# EAGLE design Canzasi-Prot (EAGLE 7.6.0)
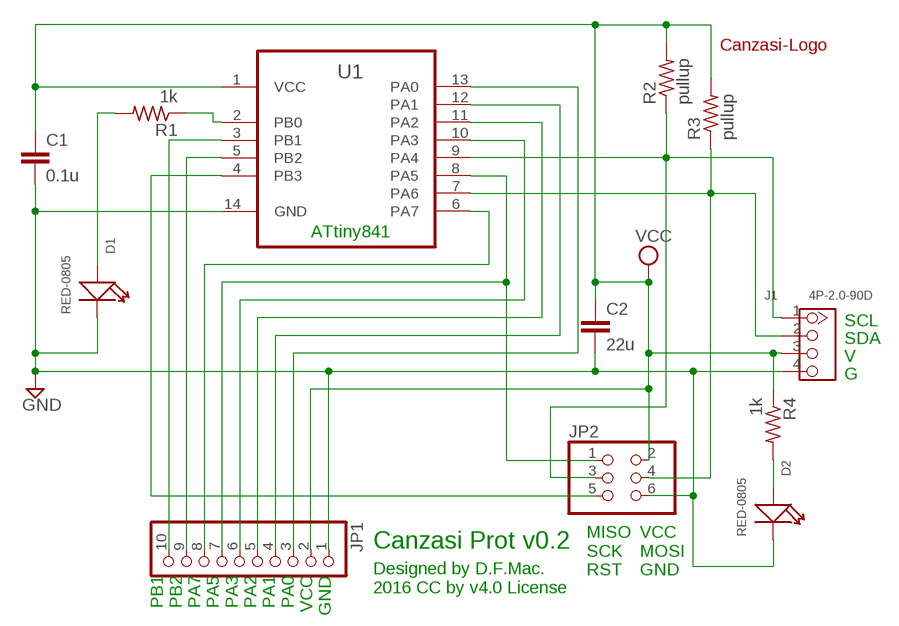
[diagram p0: schematic, sheet 1]

## Parts
C1  0.1u  C-EUC0603  [C0603]
C2  22u  C-EUC0805  [C0805]
D1  RED-0805  SMD-LED-CLEAR-RED(0805)  [LED-0805]
D2  RED-0805  SMD-LED-CLEAR-RED(0805)  [LED-0805]
J1  4P-2.0-90D  GROVE-CONNECTOR-DIP-90D(4P-2.0)  [HW4-2.0-90D]
JP1  PINHD-1X10  [1X10]
JP2  PINHD-2X3  [2X03]
R1  1k  R-US_R0603  [R0603]
R2  pullup  R-US_R0603  [R0603]
R3  pullup  R-US_R0603  [R0603]
R4  1k  R-US_R0603  [R0603]
U1  ATTINY44A-SSU  [SOIC127P600X175-14N]
U$1  CANZASI-LOGOMEDIUM  [CANZASI-LOGO-MEDIUM]

## Nets
GND [GND]: C1.2 C2.2 D1.- D2.- J1.4 JP1.1 JP2.6 U1.14(GND)
N$1: R1.1 U1.2(PB0)
N$2: D1.+ R1.2
N$3: J1.2 JP2.4 R3.1 U1.7(PA6)
N$4: J1.1 JP2.3 R2.1 U1.9(PA4)
N$5: JP1.10 U1.3(PB1)
N$6: JP1.9 U1.5(PB2)
N$7: JP2.5 U1.4(PB3)
N$8: JP1.8 U1.6(PA7)
N$9: JP1.7 JP2.1 U1.8(PA5)
N$10: JP1.6 U1.10(PA3)
N$11: JP1.5 U1.11(PA2)
N$12: JP1.4 U1.12(PA1)
N$13: JP1.3 U1.13(PA0)
N$14: D2.+ R4.2
VCC [VCC]: C1.1 C2.1 J1.3 JP1.2 JP2.2 R2.2 R3.2 R4.1 U1.1(VCC)

## Notes on the sheet
- ATtiny841
- SCL
- SDA
- V
- G
- Canzasi Prot v0.2
- PB1
  PB2
  PA7
  PA5
  PA3
  PA2
  PA1
  PA0
  VCC
  GND
- MISO
  SCK
  RST
- VCC
  MOSI
  GND
- Designed by D.F.Mac.
  2016 CC by v4.0 License

## Library data of the parts
C1 C2 = 0my:C-EU: CAPACITOR, European symbol
D1 D2 = Seeed-OPL-Diode:SMD-LED-CLEAR-RED(0805): 304090046; MPN: 17-215SURC/S530-A2/TR8
J1 = Seeed-OPL-Connector:GROVE-CONNECTOR-DIP-90D(4P-2.0): 320110034
JP1 = 0my:PINHD-1X10: PIN HEADER
JP2 = 0my:PINHD-2X3: PIN HEADER
R1-R4 = 0my:R-US_: RESISTOR, American symbol
U1 = Atmel_By_element14_Batch_1-00:ATTINY44A-SSU: 8-bit Microcontroller with In-System Programmable Flash; MPN: ATTINY44A-SSU; OC_FARNELL: 1699397; OC_NEWARK: 80P3683; PACKAGE: SOIC-14; SUPPLIER: Atmel
U$1 = 1my:CANZASI-LOGO

## Net classes
0 default: width 0.33 mm, drill 0.178 mm, clearance 0.152 mm
1 VCC: width 0.508 mm, drill 0.178 mm, clearance 0.152 mm
2 GND: width 0.508 mm, drill 0.178 mm, clearance 0.152 mm

## Board
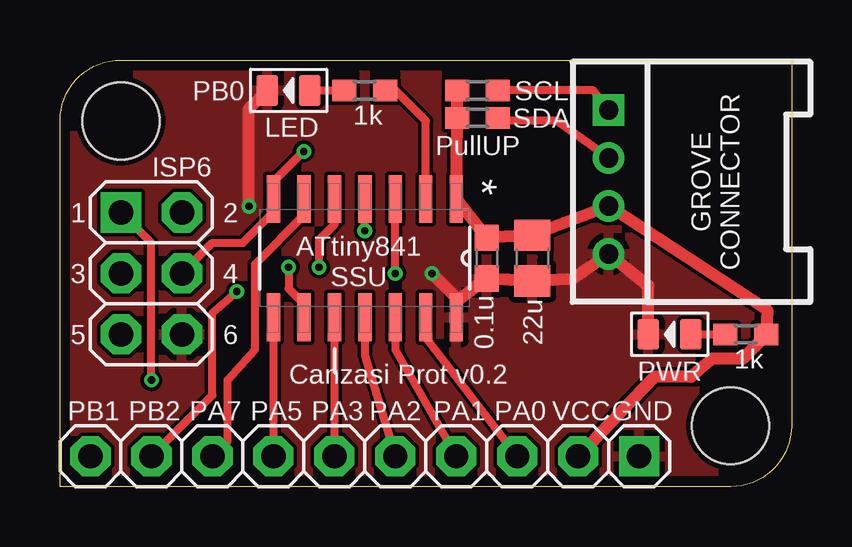
[diagram p1: board, top side]
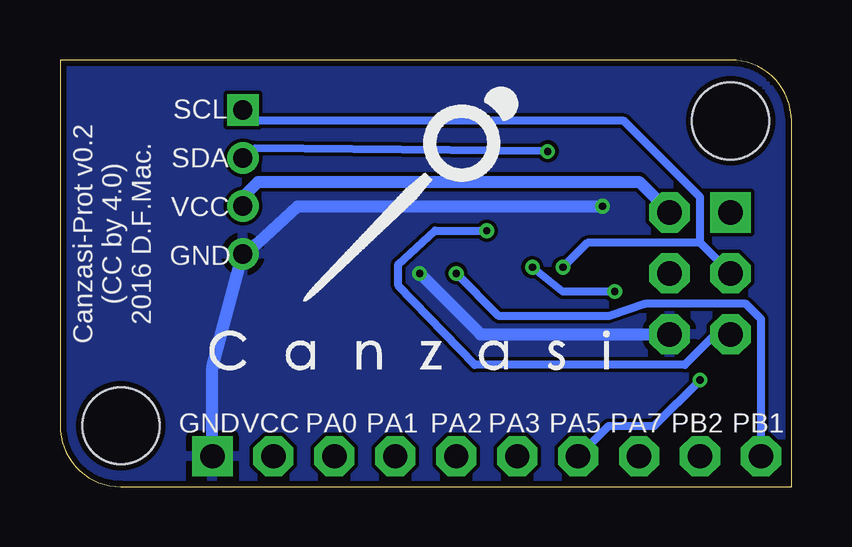
[diagram p2: board, bottom side, seen from below]

Size 30.48 x 17.78 mm. Coordinates in mm from the lower left corner, seen from the top.
Outline: 0,0 0,15.24 arc-90 2.54,17.78 30.48,17.78 30.48,2.54 arc-90 27.94,0 0,0
Copper layers (1*16): Top 0.035mm / dielectric 1.5mm / Bottom 0.035mm
Design rules "Elecrow_2-layer_eagle_rule": minimum track width 6mil, minimum drill 12mil, track to track 6mil, track to pad 6mil, pad to pad 6mil, via to via 6mil, smd to smd 0mil, copper to edge 10mil, drill to drill 10mil, minimum pad ring 10mil, minimum via ring 6mil, stop-mask expansion 2mil, vias tented up to drill 100mil, thermal gap 10mil
Holes 3.2 mm at 2.54,15.24 27.94,2.54

### Footprints (pad centres in the part's own frame; a part is rotated, then mirrored left to right if it is on the bottom)
C0603 = smd 1.1 x 1: 1 -0.85,0; 2 0.85,0
C0805 = smd 1.3 x 1.5: 1 -0.95,0; 2 0.95,0
LED-0805 = smd 0.889 x 1.27: + -0.889,0; - 0.889,0
HW4-2.0-90D = drill 0.8 pad 1.27 square: 1 -3,0 | drill 0.8 pad 1.27: 2 -1,0; 3 1,0; 4 3,0
1X10 = drill 1.016 pad 1.676 square: 1 -11.43,0 | drill 1.016 pad 1.676 octagon: 2 -8.89,0; 3 -6.35,0; 4 -3.81,0; 5 -1.27,0; 6 1.27,0; 7 3.81,0; 8 6.35,0; 9 8.89,0; 10 11.43,0
2X03 = drill 1.016 pad 1.676 square: 1 -2.54,-1.27 | drill 1.016 pad 1.676 octagon: 2 -2.54,1.27; 3 0,-1.27; 4 0,1.27; 5 2.54,-1.27; 6 2.54,1.27
R0603 = smd 1 x 0.9: 1 -0.85,0; 2 0.85,0
SOIC127P600X175-14N = smd 1.981 x 0.559: 1 -2.464,3.81; 2 -2.464,2.54; 3 -2.464,1.27; 4 -2.464,0; 5 -2.464,-1.27; 6 -2.464,-2.54; 7 -2.464,-3.81; 8 2.464,-3.81; 9 2.464,-2.54; 10 2.464,-1.27; 11 2.464,0; 12 2.464,1.27; 13 2.464,2.54; 14 2.464,3.81

### Placement (x,y rotation side)
C1  17.78,9.53 270 top
C2  19.68,9.53 270 top
D1  9.53,16.51 180 top
D2  25.4,6.35 180 top
J1  22.86,12.7 270 top
JP1  12.7,1.27 180 top
JP2  3.81,8.89 270 top
R1  12.7,16.51 180 top
R2  17.4,16.51 180 top
R3  17.4,15.37 180 top
R4  28.57,6.35 180 top
U1  12.7,9.53 270 top
U$1  25.02,4.06 0 bottom

### Tracks (layer width: path | path; a pad name or v marks a point on that pad's centre or on a via)
GND  (via drill 0.3)
  Top 0.508: 16.52,7.71 C1.2 C2.2 21.34,8.64 J1.4 24.51,8.38 D2.- | 16.52,7.71 U1.14 | D1.- 7.87,15.75 v7.87,11.68 | v15.49,8.89 16.51,7.87 16.51,7.62 16.52,7.71
  Bottom 0.508: JP1.1 24.13,4.95 J1.4 22.86,9.65 22.23,10.16 20.57,11.68 v7.87,11.68 | v15.49,8.89 12.95,6.35 JP2.6
  pour Top: 0.64,17.14 30.48,17.14 30.48,0.64 0.64,0.64
  pour Bottom: -0.64,17.78 31.11,17.78 31.11,0 -0.64,0
N$1
  Top 0.33: U1.2 15.24,15.24 13.97,16.51 R1.1
N$2
  Top 0.33: D1.+ R1.2
N$3  (via drill 0.3)
  Top 0.33: 22.86,13.72 20.7,15.24 18.41,15.24 R3.1 | 22.86,13.84 22.86,13.72 | 22.86,13.72 J1.2 | JP2.4 6.35,10.16 7.62,10.16 8.89,11.43 U1.7 8.89,12.7 v10.16,13.97
  Bottom 0.33: v10.16,13.97 22.35,14.1 J1.2
N$4  (via drill 0.3)
  Top 0.33: R2.1 22.23,16.51 J1.1 | v9.53,9.14 9.53,8.26 10.16,7.62 U1.9
  Bottom 0.33: v9.53,9.14 8.51,10.16 3.81,10.16 | JP2.3 3.81,10.16 | 3.81,10.16 3.81,12.06 6.99,15.24 22.48,15.24 J1.1
N$5  (via drill 0.3)
  Top 0.33: v13.97,8.89 U1.3
  Bottom 0.33: v13.97,8.89 12.19,7.11 7.62,7.11 6.1,7.62 1.91,7.62 1.27,6.99 JP1.10
N$6  (via drill 0.3)
  Top 0.33: v10.79,9.14 10.79,10.29 11.43,10.92 U1.5 | v7.37,8.13 6.35,7.24 6.35,3.81 JP1.9
  Bottom 0.33: v10.79,9.14 9.53,8.13 v7.37,8.13
N$7  (via drill 0.3)
  Top 0.33: v12.7,10.67 U1.4
  Bottom 0.33: v12.7,10.67 14.86,10.67 16.38,9.27 16.38,8.38 13.21,5.08 4.45,5.08 3.17,6.35 JP2.5
N$8
  Top 0.33: JP1.8 6.99,1.91 6.99,4.45 8.13,5.71 8.13,9.27 10.16,11.3 U1.6
N$9  (via drill 0.3)
  Top 0.33: U1.8 JP1.7 | JP2.1 3.81,10.16 v3.81,4.45
  Bottom 0.33: v3.81,4.45 5.71,2.54 7.62,2.54 JP1.7
N$10
  Top 0.33: U1.10 JP1.6
N$11
  Top 0.33: U1.11 12.7,5.46 JP1.5
N$12
  Top 0.33: U1.12 13.97,5.71 JP1.4
N$13
  Top 0.33: U1.13 15.24,6.22 JP1.3
N$14
  Top 0.33: D2.+ R4.2
VCC
  Top 0.508: R2.2 R3.2 U1.1 C1.1 C2.1 22.86,11.68 J1.3 29.46,7.37 R4.1 28.45,5.33 27.18,5.33 26.29,4.57 24.77,4.57 JP1.2
  Bottom 0.508: JP2.2 6.35,12.7 22.23,12.7 22.86,12.06 J1.3

### Text on the board
tNames: PB0 | SCL | LED | 1k | SDA | PullUP | ISP6 | GROVE / CONNECTOR | 1 | 2 | ATtiny841 | 3 | 4 | SSU | 0.1u | 22u | 5 | 6 | Canzasi Prot v0.2 | PWR | 1k | PB1 | PB2 | PA7 | PA5 | PA3 | PA2 | PA1 | PA0 | VCC | GND
bNames: SCL | SDA | VCC | Canzasi-Prot v0.2 / (CC by 4.0) / 2016 D.F.Mac. | GND | PB1 | PB2 | PA7 | PA5 | PA3 | PA2 | PA1 | PA0 | VCC | GND